# EasyEDA schematic ESP32_LRThermostat_Relay_Driver_Board.json
TITLE: Sheet_1; REV: 1.0; Date: 2022-02-11; Sheet: 1/1; Company: Your Company
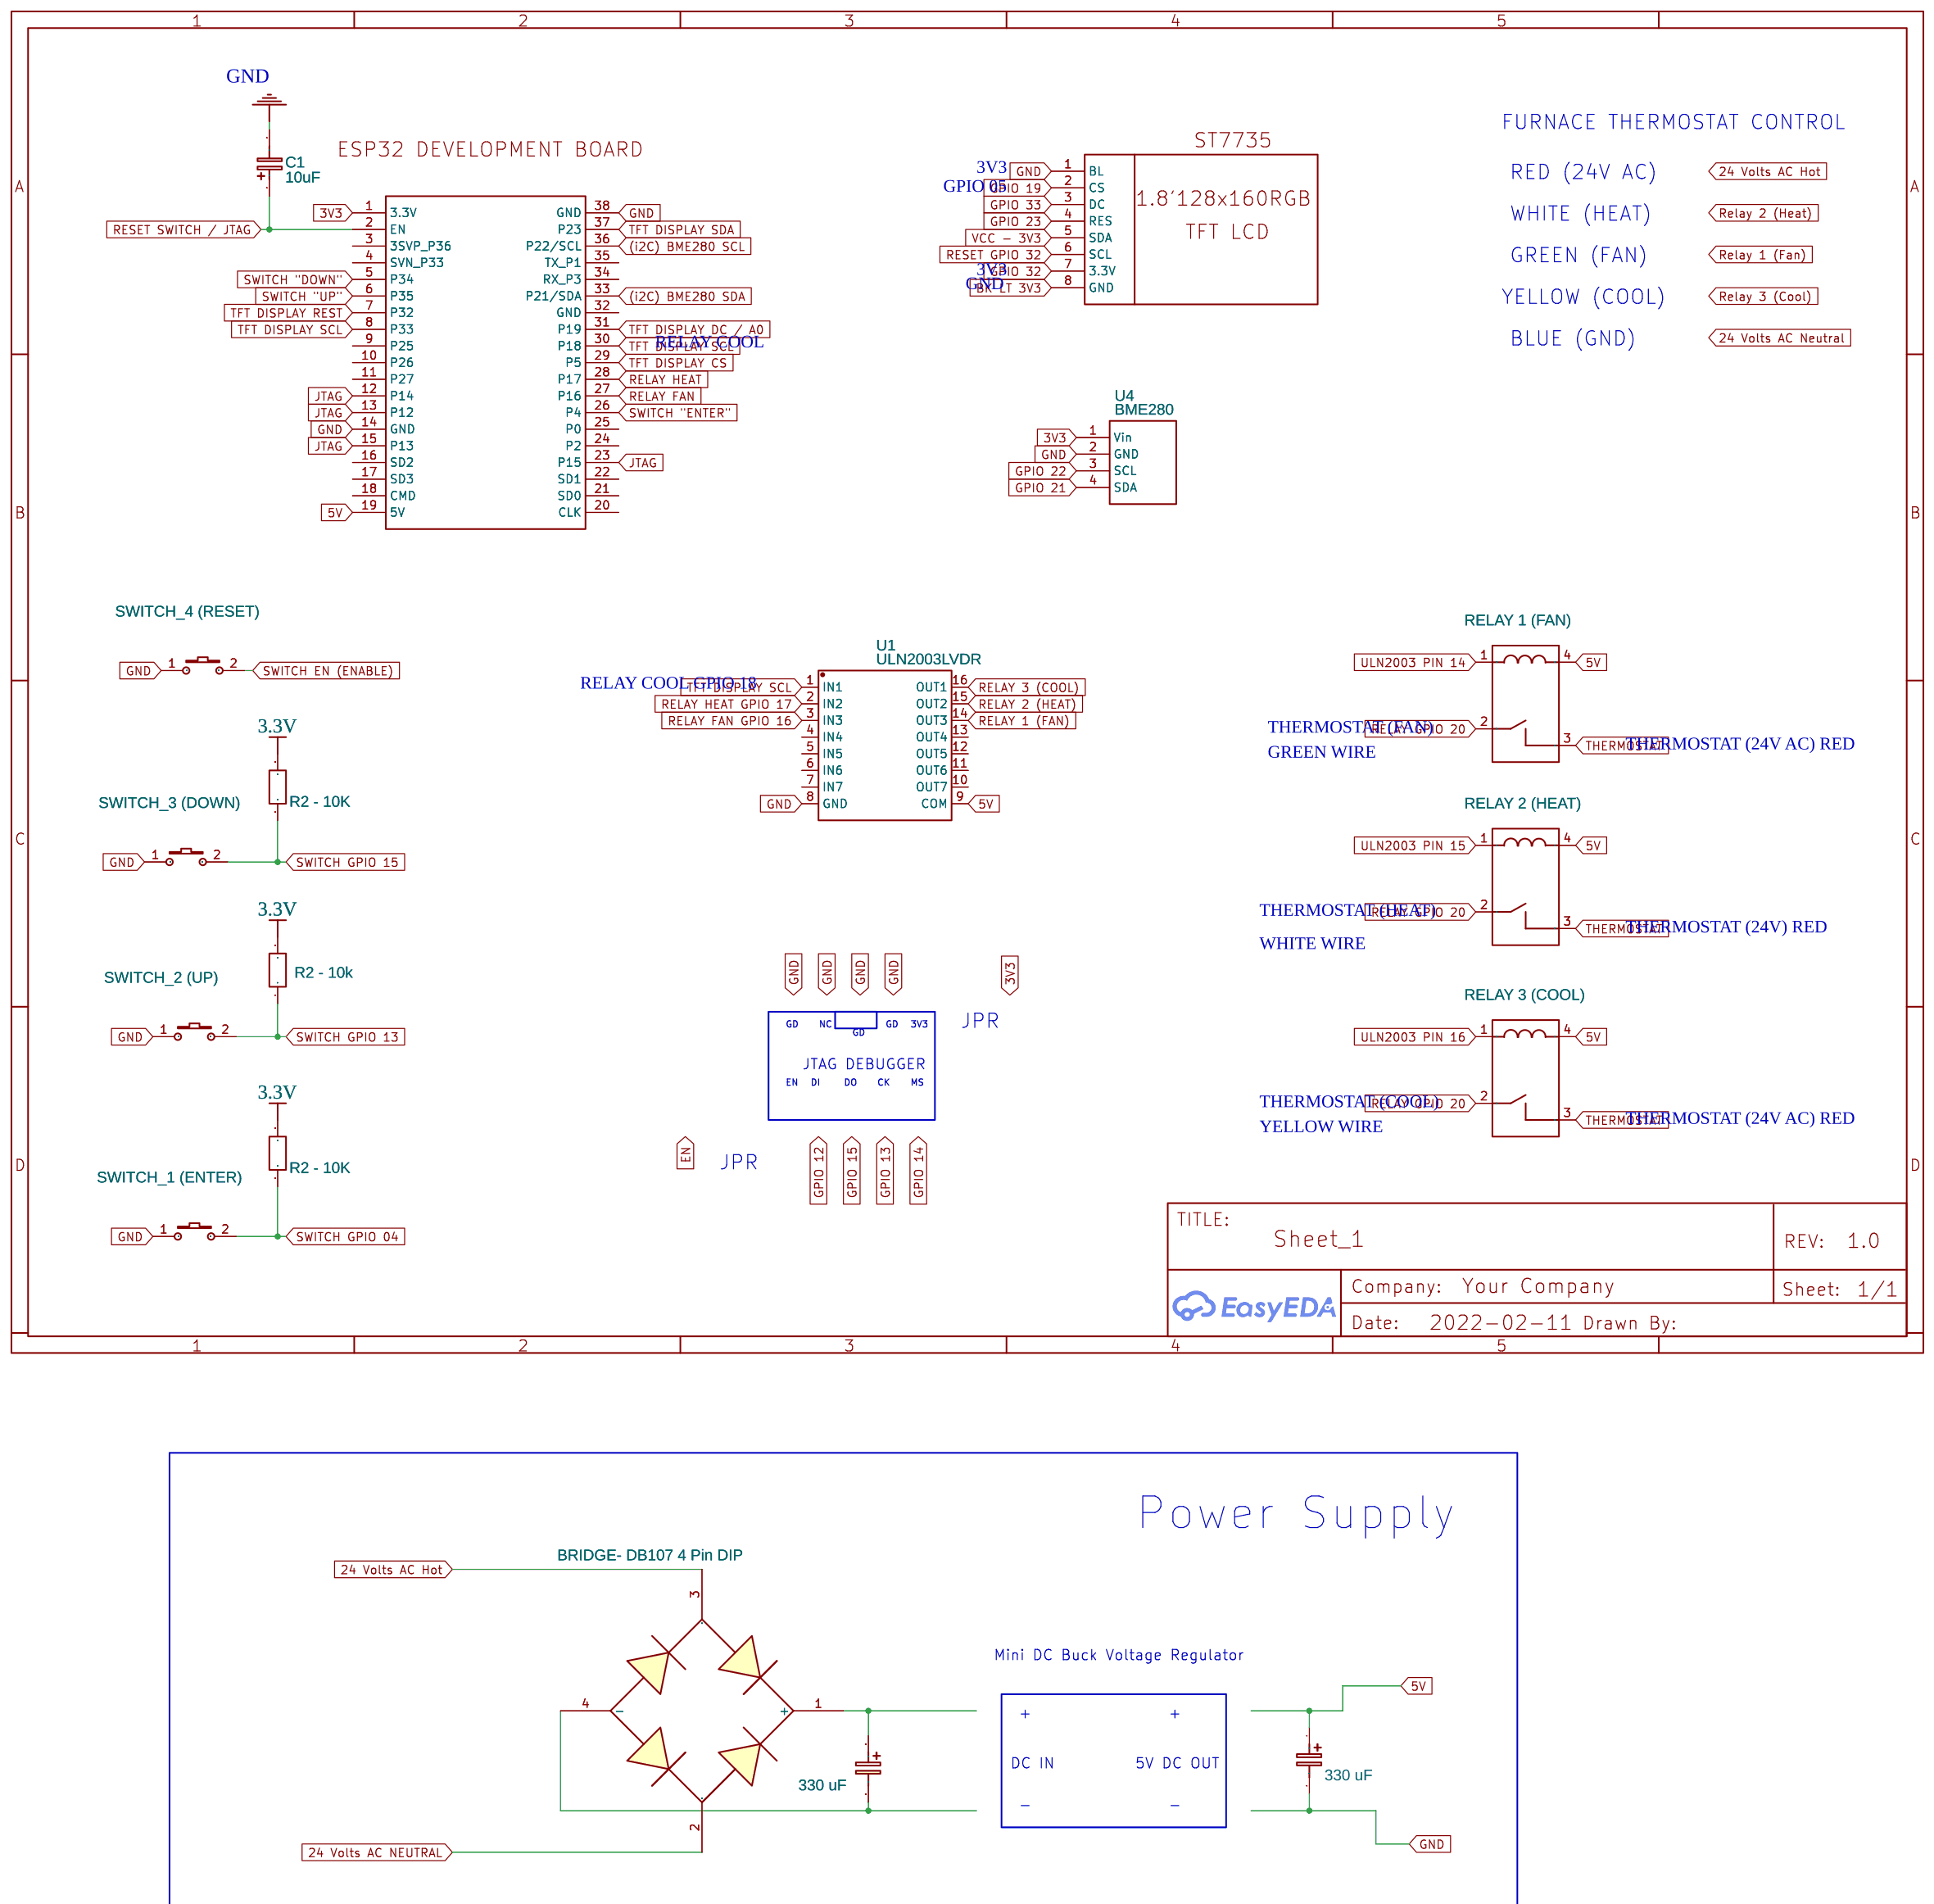
[diagram p0: schematic sheet]

## Parts
C1  10uF  [CASE-A_3216]
C2  330 uF  [CASE-A_3216]
C3  330 uF  [CASE-A_3216]
D1  BRIDGE- DB107 4 Pin DIP
K1  RELAY 2 (HEAT)  [RELAY-TH_RJ-SS-XXXXMX]
K2  RELAY 3 (COOL)  [RELAY-TH_RJ-SS-XXXXMX]
K4  RELAY 1 (FAN)  [RELAY-TH_RJ-SS-XXXXMX]
KEY1  SWITCH_4 (RESET)  [KEY-SMD_2P-L6.2-W3.6-LS8.0]
KEY4  SWITCH_3 (DOWN)  [KEY-SMD_2P-L6.2-W3.6-LS8.0]
KEY5  SWITCH_1 (ENTER)  [KEY-SMD_2P-L6.2-W3.6-LS8.0]
KEY6  SWITCH_2 (UP)  [KEY-SMD_2P-L6.2-W3.6-LS8.0]
R1  R2 - 10k  [R0603]
R2  R2 - 10K  [R0603]
R3  R2 - 10K  [R0603]
U1  ULN2003LVDR  [SOIC-16_L9.9-W3.9-P1.27-LS6.0-BL]
U2  ESP32S Devkit  [ESP-WROOM-32 DEV KIT]
U3  ST7735  [ST7735]
U4  BME280  [BME280]

## Library data of the parts
C1-C3 = C_Tan_SMD_A_EU: Contributor: LCEDA_Lib
D1 = BRIDGE-1: Contributor: KiCad
K1 K2 K4 = RJ-SS-112DM1-S: Supplier: LCSC; Supplier Part: C358580; Manufacturer: Wangrong; Contributor: LCSC; JLCPCB Part Class: Extended Part
KEY1 KEY4-KEY6 = K2-3.6×6.1_SMD: Supplier Part: C118141; Supplier: LCSC; Manufacturer Part: K2-1107ST-A4SW-06; Contributor: LCEDA_Lib; 制造商: 韩国韩荣
R1-R3 = R_0603_EU: Contributor: LCEDA_Lib
U1 = ULN2003LVDR: Supplier: LCSC; Supplier Part: C72751; Manufacturer: Texas Instruments; Contributor: LCSC; JLCPCB Part Class: Extended Part
U2 = ESP32S Devkit: Manufacturer Part: New SchematicLib; Contributor: maroofaslamfas
U3 = ST7735: Contributor: Andrey-iv
U4 = BME280: Contributor: Kuba Jaszczur

## Nets
3.3V: R1.2 R2.2 R3.2
3V3: U2.1(3.3V) U4.1(Vin)
5V: C3.1 K1.4 K2.4 K4.4 U1.9(COM) U2.19(5V)
GND: C1.2 C3.2 KEY1.1 KEY4.1 KEY5.1 KEY6.1 U1.8(GND) U2.14(GND) U2.38(GND) U3.1(BL) U4.2(GND)
VCC - 3V3: U3.5(SDA)
24 Volts AC Hot: D1.3
24 Volts AC NEUTRAL: D1.2
(i2C) BME280 SCL: U2.36(P22/SCL)
(i2C) BME280 SDA: U2.33(P21/SDA)
BK LT 3V3: U3.8(GND)
GPIO 19: U3.2(CS)
GPIO 21: U4.4(SDA)
GPIO 22: U4.3(SCL)
GPIO 23: U3.4(RES)
GPIO 32: U3.7(3.3V)
GPIO 33: U3.3(DC)
JTAG: U2.12(P14) U2.13(P12) U2.15(P13) U2.23(P15)
RELAY 1 (FAN): U1.14(OUT3)
RELAY 2 (HEAT): U1.15(OUT2)
RELAY 3 (COOL): U1.16(OUT1)
RELAY FAN: U2.27(P16)
RELAY FAN GPIO 16: U1.3(IN3)
RELAY GPIO 20: K1.2 K2.2 K4.2
RELAY HEAT: U2.28(P17)
RELAY HEAT GPIO 17: U1.2(IN2)
RESET GPIO 32: U3.6(SCL)
RESET SWITCH / JTAG: C1.1 U2.2(EN)
SWITCH "DOWN": U2.5(P34)
SWITCH "ENTER": U2.26(P4)
SWITCH "UP": U2.6(P35)
SWITCH EN (ENABLE): KEY1.2
SWITCH GPIO 04: KEY5.2 R2.1
SWITCH GPIO 13: KEY6.2 R1.1
SWITCH GPIO 15: KEY4.2 R3.1
TFT DISPLAY CS: U2.29(P5)
TFT DISPLAY DC / A0: U2.31(P19)
TFT DISPLAY REST: U2.7(P32)
TFT DISPLAY SCL: U1.1(IN1) U2.8(P33) U2.30(P18)
TFT DISPLAY SDA: U2.37(P23)
THERMOSTAT: K1.3 K2.3 K4.3
ULN2003 PIN 14: K4.1
ULN2003 PIN 15: K1.1
ULN2003 PIN 16: K2.1
Net-(C2-1): C2.1 D1.1(+)
Net-(C2-2): C2.2 D1.4(-)

Not connected (* = marked no-connect by the designer): U1 4(IN4) 5(IN5) 6(IN6) 7(IN7) 10(OUT7) 11(OUT6) 12(OUT5) 13(OUT4); U2 3(3SVP P36) 4(SVN P33) 9(P25) 10(P26) 11(P27) 16(SD2) 17(SD3) 18(CMD) 20(CLK) 21(SD0) 22(SD1) 24(P2) 25(P0) 32(GND) 34(RX P3) 35(TX P1)

## Notes on the sheet
- FURNACE THERMOSTAT CONTROL
- 3V3
- RED (24V AC)
- GPIO 05
- WHITE (HEAT)
- GREEN (FAN)
- 3V3
- GND
- YELLOW (COOL)
- BLUE (GND)
- RELAY COOL
- RELAY COOL GPIO 18
- THERMOSTAT (FAN)
- GREEN WIRE
- THERMOSTAT (24V AC) RED
- THERMOSTAT (HEAT)
- THERMOSTAT (24V) RED
- WHITE WIRE
- GD
- NC
- GD
- 3V3
- JPR
- GD
- JTAG DEBUGGER
- EN
- DI
- DO
- CK
- MS
- THERMOSTAT (COOL)
- THERMOSTAT (24V AC) RED
- YELLOW WIRE
- JPR
- Power Supply
- Mini DC Buck Voltage Regulator
- +
- +
- DC IN
- 5V DC OUT
- -
- -
